# EAGLE design Arky TR595 Top Panel Eagle (EAGLE 7.7.0)
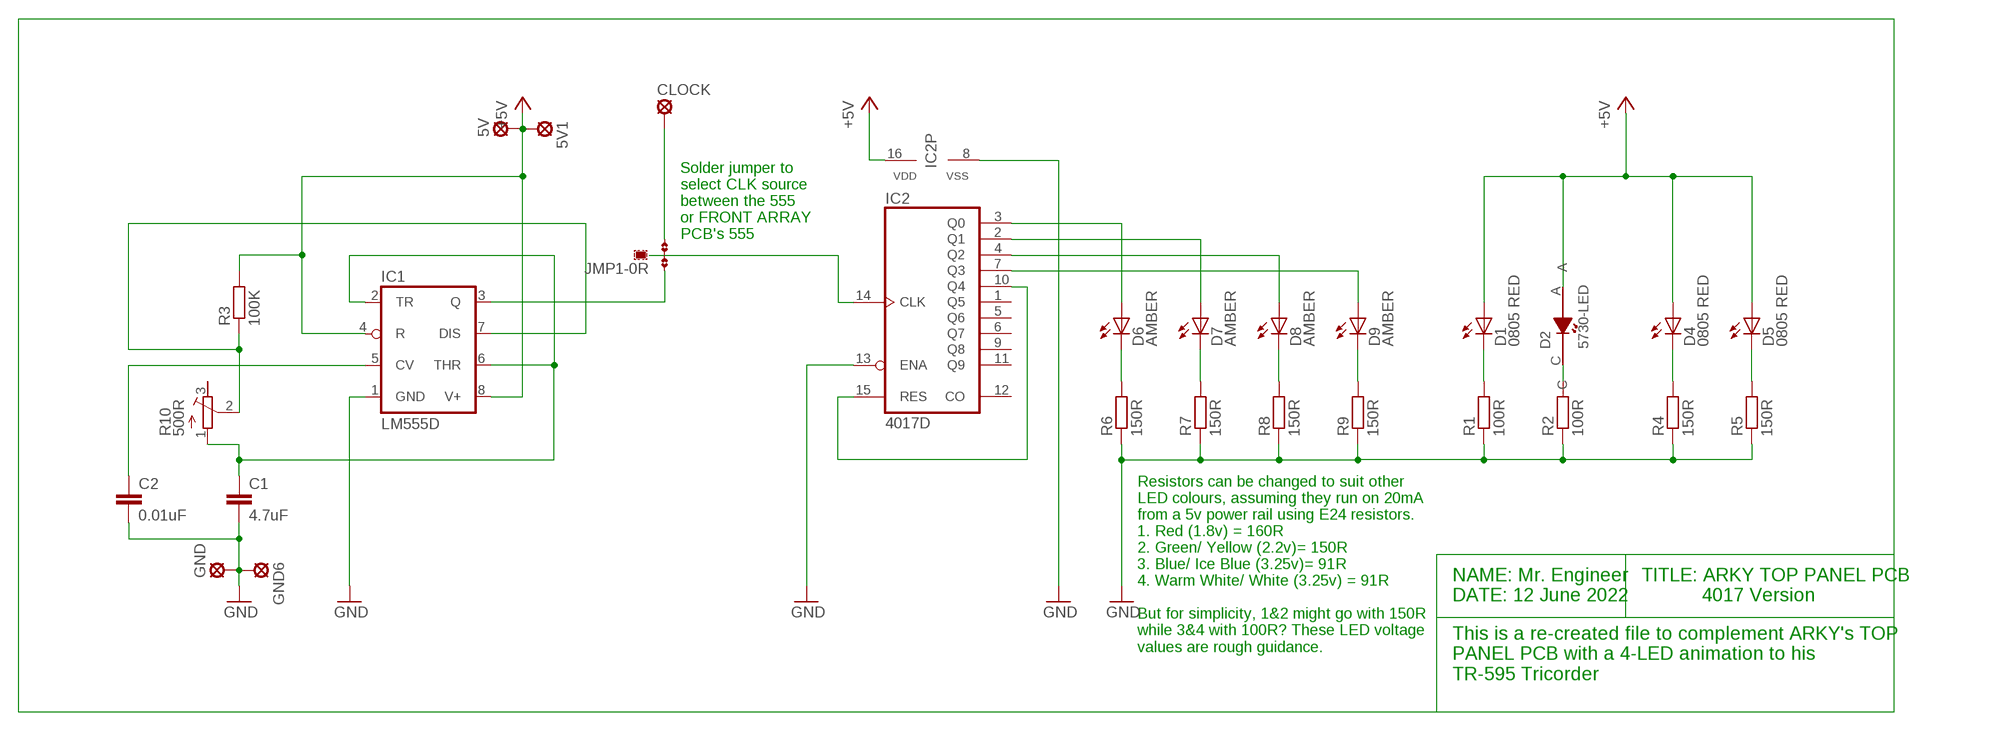
[diagram p0: schematic, sheet 1]

## Parts
5V  MCS10B  [MCS10B]
5V1  MCS10B  [MCS10B]
C1  4.7uF  C-EUC0805  [C0805]
C2  0.01uF  C-EUC0805  [C0805]
CLOCK  MCS10B  [MCS10B]
D1  0805 RED  LEDCHIPLED_0805  [CHIPLED_0805]
D2  5730-LED  [5730-LED]
D4  0805 RED  LEDCHIPLED_0805  [CHIPLED_0805]
D5  0805 RED  LEDCHIPLED_0805  [CHIPLED_0805]
D6  AMBER  LEDCHIPLED_0805  [CHIPLED_0805]
D7  AMBER  LEDCHIPLED_0805  [CHIPLED_0805]
D8  AMBER  LEDCHIPLED_0805  [CHIPLED_0805]
D9  AMBER  LEDCHIPLED_0805  [CHIPLED_0805]
GND  MCS10B  [MCS10B]
GND6  MCS10B  [MCS10B]
IC1  LM555D  [SO08]
IC2  4017D  [SO16]
JMP1  0R-JUMPA  [A0R-JMP]
R1  100R  R-EU_R0805  [R0805]
R2  100R  R-EU_R0805  [R0805]
R3  100K  R-EU_R0805  [R0805]
R4  150R  R-EU_R0805  [R0805]
R5  150R  R-EU_R0805  [R0805]
R6  150R  R-EU_R0805  [R0805]
R7  150R  R-EU_R0805  [R0805]
R8  150R  R-EU_R0805  [R0805]
R9  150R  R-EU_R0805  [R0805]
R10  500R  R-TRIMM3103  [RTRIM3103]

## Nets
+5V: 5V1.MP 5V.MP D1.A D2.A D4.A D5.A IC1.4(R) IC1.8(V+) IC2.16(VDD) R3.2
GND: IC2.8(VSS)
N$1: IC1.3(Q) JMP1.1
N$2: C2.1 IC1.5(CV)
N$3: D6.C R6.2
N$4: D7.C R7.2
N$5: D8.C R8.2
N$6: D9.C R9.2
N$7: C1.1 IC1.2(TR) IC1.6(THR) R10.1(A)
N$8: D6.A IC2.3(Q0)
N$9: D7.A IC2.2(Q1)
N$10: D8.A IC2.4(Q2)
N$11: D9.A IC2.7(Q3)
N$12: IC2.10(Q4) IC2.15(RES)
N$13: D4.C R4.2
N$14: D5.C R5.2
N$15: D1.C R1.2
N$16: D2.C R2.2
N$17: IC1.7(DIS) R3.1 R10.2(S)
N$18: IC2.14(CLK) JMP1.2
N$20: CLOCK.MP JMP1.3
N$21: C1.2 C2.2 GND6.MP GND.MP IC1.1(GND) IC2.13(ENA) R1.1 R2.1 R4.1 R5.1 R6.1 R7.1 R8.1 R9.1 ; supply symbol labelled GND
Unconnected: IC2.1(Q5) IC2.5(Q6) IC2.6(Q7) IC2.9(Q8) IC2.11(Q9) IC2.12(CO) R10.3(E)

## Notes on the sheet
- Solder jumper to
  select CLK source
  between the 555
  or FRONT ARRAY
  PCB's 555
- Resistors can be changed to suit other
  LED colours, assuming they run on 20mA
  from a 5v power rail using E24 resistors.
  1. Red (1.8v) = 160R
  2. Green/ Yellow (2.2v)= 150R
  3. Blue/ Ice Blue (3.25v)= 91R
  4. Warm White/ White (3.25v) = 91R
  
  But for simplicity, 1&2 might go with 150R
  while 3&4 with 100R? These LED voltage
  values are rough guidance.
- NAME: Mr. Engineer
  DATE: 12 June 2022
- TITLE: ARKY TOP PANEL PCB
             4017 Version
- This is a re-created file to complement ARKY's TOP
  PANEL PCB with a 4-LED animation to his
  TR-595 Tricorder

## Library data of the parts
5V 5V1 CLOCK GND GND6 = solpad:MCS10B: SOLDER PAD MC S1, distributor Buerklin, 15F505
C1 C2 = rcl:C-EU: CAPACITOR, European symbol
D1 D4-D9 = led:LED: LED OSRAM: - CHIPLED LG R971, LG N971, LY N971, LG Q971, LY Q971, LO R971, LY R971 LH N974, LH R974 LS Q976, LO Q976, LY Q976 LO Q996 - Hyper CHIPLED LW Q18S LB Q993, LB Q99A, LB R99A - SideLED LS A670, LO A670, LY A670, LG A670, LP A670 LB A673, LV A673, LT A673, LW A673 LH A674 LY A675 LS A676, LA A676, LO A676, LY A676, LW A676 LS A679, LY A679, LG A679 - Hyper Micro SIDELED® LS Y876, LA Y876, LO Y876, LY Y876 LT Y87S - SmartLED LW L88C, LW L88S LB L89C, LB L89S, LG L890 LS L89K, LO L89K, LY L89K LS L896, LA L896, LO L896, LY L896 - TOPLED LS T670, LO T670, LY T670, LG T670, LP T670 LSG T670, LSP T670, LSY T670, LOP T670, LYG T670 LG T671, LOG T671, LSG T671 LB T673, LV T673, LT T673, LW T673 LH T674 LS T676, LA T676, LO T676, LY T676, LB T676, LH T676, LSB T676, LW T676 LB T67C, LV T67C, LT T67C, LS T67K, LO T67K, LY T67K, LW E67C LS E67B, LA E67B, LO E67B, LY E67B, LB E67C, LV E67C, LT E67C LW T67C LS T679, LY T679, LG T679 LS T770, LO T770, LY T770, LG T770, LP T770 LB T773, LV T773, LT T773, LW T773 LH T774 LS E675, LA E675, LY E675, LS T675 LS T776, LA T776, LO T776, LY T776, LB T776 LHGB T686 LT T68C, LB T68C - Hyper Mini TOPLED® LB M676 - Mini TOPLED Santana® LG M470 LS M47K, LO M47K, LY M47K Source: http://www.osram.convergy.de LUXEON: - LUMILED® LXK2-PW12-R00, LXK2-PW12-S00, LXK2-PW14-U00, LXK2-PW14-V00 LXK2-PM12-R00, LXK2-PM12-S00, LXK2-PM14-U00 LXK2-PE12-Q00, LXK2-PE12-R00, LXK2-PE12-S00, LXK2-PE14-T00, LXK2-PE14-U00 LXK2-PB12-K00, LXK2-PB12-L00, LXK2-PB12-M00, LXK2-PB14-N00, LXK2-PB14-P00, LXK2-PB14-Q00 LXK2-PR12-L00, LXK2-PR12-M00, LXK2-PR14-Q00, LXK2-PR14-R00 LXK2-PD12-Q00, LXK2-PD12-R00, LXK2-PD12-S00 LXK2-PH12-R00, LXK2-PH12-S00 LXK2-PL12-P00, LXK2-PL12-Q00, LXK2-PL12-R00 Source: www.luxeon.com KINGBRIGHT: KA-3528ASYC Source: www.kingbright.com
D2 = Chow 5730 LED:5730-LED
IC1 = adafruit:*555: TIMER Changed DIP package to have round (not oval) pin pads http://www.ladyada.net/library/pcb/eaglelibrary.html
IC2 = 40xx:4017: COUNTER/DIVIDER
JMP1 = jump-0r-smd:0R-JUMP: SMD 0R 0805 Jumper
R1-R9 = rcl:R-EU_: RESISTOR, European symbol
R10 = rcl:R-TRIMM: Trimm resistor

## Board
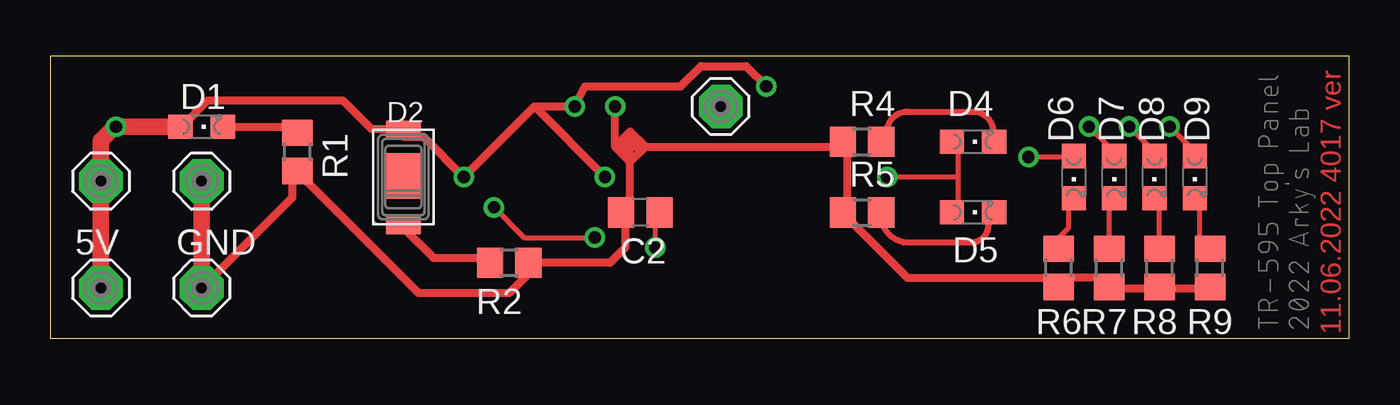
[diagram p1: board, top side]
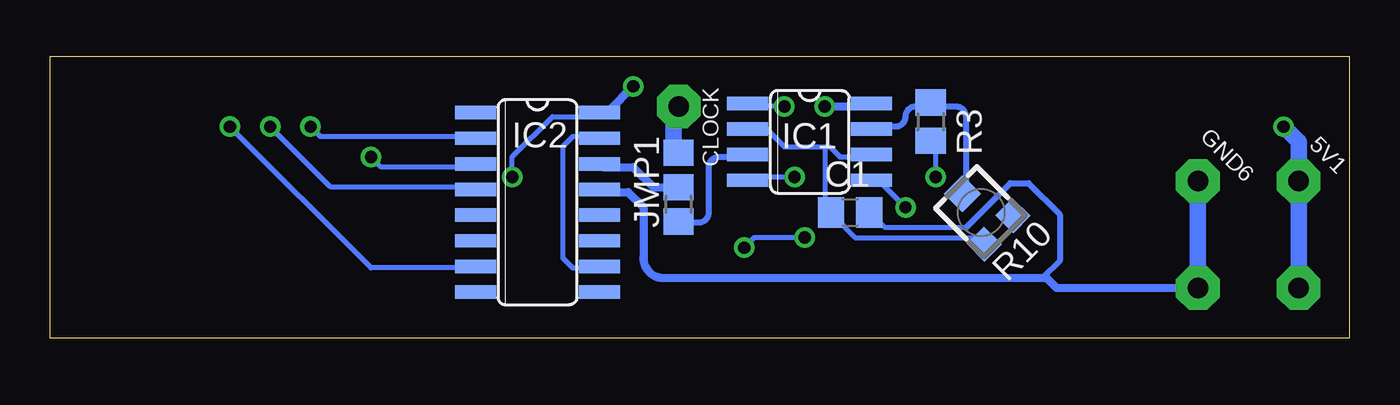
[diagram p2: board, bottom side, seen from below]

Size 64.4 x 14 mm. Coordinates in mm from the lower left corner, seen from the top.
Outline: 0,0 64.4,0 64.4,14 0,14 0,0
Copper layers (1*16): Top 0.035mm / dielectric 1.5mm / Bottom 0.035mm
Design rules "default": minimum track width 10mil, minimum drill 24mil, track to track 8mil, track to pad 8mil, pad to pad 8mil, via to via 8mil, smd to smd 8mil, copper to edge 40mil, drill to drill 8mil, minimum pad ring 10mil, minimum via ring 8mil, stop-mask expansion 4mil, vias tented up to drill 0mil, thermal gap 10mil

### Footprints (pad centres in the part's own frame; a part is rotated, then mirrored left to right if it is on the bottom)
MCS10B = drill 1.016 pad 2.159 octagon: MP 0,0
C0805 = smd 1.3 x 1.5: 1 -0.95,0; 2 0.95,0
CHIPLED_0805 = smd 1.2 x 1.2: A 0,-1.05; C 0,1.05
5730-LED = smd 0.9 x 1.7: A -2.35,0; C 2.38,0 | smd 2.25 x 1.7: P$2 -0.055,0
SO08 = smd 0.66 x 2.032: 1 -1.905,-3.073; 2 -0.635,-3.073; 3 0.635,-3.073; 4 1.905,-3.073; 5 1.905,3.073; 6 0.635,3.073; 7 -0.635,3.073; 8 -1.905,3.073
SO16 = smd 0.66 x 2.032: 1 -4.445,-3.073; 2 -3.175,-3.073; 3 -1.905,-3.073; 4 -0.635,-3.073; 5 0.635,-3.073; 6 1.905,-3.073; 7 3.175,-3.073; 8 4.445,-3.073; 9 4.445,3.073; 10 3.175,3.073; 11 1.905,3.073; 12 0.635,3.073; 13 -0.635,3.073; 14 -1.905,3.073; 15 -3.175,3.073; 16 -4.445,3.073
A0R-JMP = smd 1.5 x 1.3: 1 0,1.7; 2 0,0; 3 0,-1.7
R0805 = smd 1.3 x 1.5: 1 -0.95,0; 2 0.95,0
RTRIM3103 = smd 1.2 x 1.25: 1 -1,-1.225; 3 1,-1.225 | smd 1.3 x 1.3: 2 0,1.3

### Placement (x,y rotation side)
5V  2.5,2.5 0 top
5V1  2.5,7.8 0 top
C1  24.75,6.25 0 bottom
C2  29.25,6.25 180 top
CLOCK  33.25,11.5 180 top
D1  7.5,10.5 270 top
D2  17.5,8 270 top
D4  45.75,9.75 270 top
D5  45.75,6.25 270 top
D6  50.75,8 180 top
D7  52.75,8 180 top
D8  54.75,8 180 top
D9  56.75,8 180 top
GND  7.5,2.5 0 top
GND6  7.5,7.8 0 top
IC1  26.75,9.75 270 bottom
IC2  40.25,6.75 270 bottom
JMP1  33.25,7.5 180 bottom
R1  12.25,9.25 90 top
R2  22.75,3.75 180 top
R3  20.75,10.75 270 bottom
R4  40.25,9.75 0 top
R5  40.25,6.25 0 top
R6  50,3.5 90 top
R7  52.5,3.5 90 top
R8  55,3.5 90 top
R9  57.5,3.5 90 top
R10  18.25,6.25 45 bottom

### Tracks (layer width: path | path; a pad name or v marks a point on that pad's centre or on a via)
+5V  (via drill 0.6, 0.61)
  Top 0.254: 45,8 45,9.5 D4.A | 45,8 45,6.5 D5.A | 45,8 v41.5,8 | 17.5,10 D2.A
  Top 0.406: 17.5,10 18.5,10 v20.5,8 24,11.5 | 24,11.5 v26,11.5 26.5,12.5 31.25,12.5 32.25,13.5 34.5,13.5 v35.5,12.5 | 24,11.5 v27.5,8 | 6.5,10.5 7.8,11.8 14.5,11.8 15.9,10.4 17.45,10.4 D2.A | v3.25,10.5 3.3,10.5 D1.A
  Top 0.813: 5V.MP 2.5,9.8 3.2,10.5 | 3.3,10.4 3.2,10.5 | 3.2,10.5 3.3,10.5 6.5,10.5
  Bottom 0.254: v41.5,8 41.5,9 39.5,11 37.5,11 IC2.16 37.75,11.25 | v20.5,8 20.5,9.5 R3.2 | 24.5,11.5 IC1.8 | v27.5,8 29.5,8 IC1.4
  Bottom 0.406: v26,11.5 24.5,11.5 | 37.75,11.25 36.75,11.25 v35.5,12.5
  Bottom 0.813: 5V.MP 5V1.MP 2.5,9.75 v3.25,10.5
N$1
  Bottom 0.254: 32.5,5.75 JMP1.1 | 30,9 IC1.3
  Bottom 0.305: 32.5,5.75 32.25,5.75 arc-90 31.75,6.25 31.75,8.5 arc90 31.25,9 29.94,9 arc-90 IC1.3
N$2  (via drill 0.61)
  Top 0.254: v30,4.5 30,6 C2.1 | v27,5 23.5,5 v22,6.5
  Bottom 0.254: v30,4.5 29.5,5 v27,5 | v22,6.5 23.5,8 IC1.5
N$3
  Top 0.254: R6.2 50,5 50.5,5.5 50.5,6.5 D6.C
N$4
  Top 0.254: R7.2 52.5,6.5 D7.C
N$5
  Top 0.254: R8.2 55,6.5 D8.C
N$6
  Top 0.254: D9.C 57,6.5 57,5 57.5,4.5 R9.2
N$7
  Bottom 0.254: R10.1 18.5,5 24.5,5 25.5,6 C1.1 26,6.5 26,9.5 | 26,9.5 28,9.5 29,10.5 29.5,10.5 IC1.2 | 26,9.5 25.75,9.5 25.25,9 23.79,9
  Bottom 0.305: 23.79,9 IC1.6
N$8  (via drill 0.61)
  Top 0.254: v48.5,9 50.5,9 D6.A
  Bottom 0.254: v48.5,9 48,8.5 43.5,8.5 IC2.3
N$9  (via drill 0.61)
  Top 0.254: v51.5,10.5 52.5,9.5 D7.A
  Bottom 0.254: v51.5,10.5 51,10 43.5,10 IC2.2
N$10  (via drill 0.61)
  Top 0.254: v53.5,10.5 54.5,9.5 D8.A
  Bottom 0.254: v53.5,10.5 50.5,7.5 43.5,7.5 IC2.4
N$11  (via drill 0.61)
  Top 0.254: v55.5,10.5 56.5,9.5 D9.A
  Bottom 0.254: v55.5,10.5 48.5,3.5 43.5,3.5 IC2.7
N$12
  Bottom 0.254: IC2.10 37.5,3.5 38.5,3.5 39,4 39,9.5 38.5,10 37,10 IC2.15
N$13
  Top 0.254: 46.5,10 D4.C | 41.5,10 R4.2
  Top 0.305: 41.5,10 41.5,10.25 arc-90 42.5,11.25 45.75,11.25 arc-90 46.75,10.25 46.75,9.8 arc90 D4.C
N$14
  Top 0.254: 46.5,6 D5.C | 41.5,6 R5.2
  Top 0.305: 46.5,6 46.5,5.75 arc-90 45.75,4.75 42.45,4.75 arc-90 R5.2
N$15
  Top 0.254: 12,10.5 R1.2
  Top 0.406: D1.C 11.95,10.5 R1.2
N$16
  Top 0.254: 21.5,4 R2.2 | 17.5,5.5 D2.C
  Top 0.406: 21.5,4 19,4 17.5,5.5
N$17
  Bottom 0.254: 20.5,11.5 R3.1 21,11.5 | 23.5,10.5 IC1.7
  Bottom 0.305: 21,11.5 21.5,11.5 arc-90 22,11 arc90 22.5,10.5 23.56,10.5 arc-90 IC1.7 | 20.5,11.5 19.5,11.5 arc90 19,11 19,7.34 arc90 R10.2
N$18
  Bottom 0.254: 37,8.5 IC2.14
  Bottom 0.406: 37,8.5 35.5,8.5 34.5,7.5 JMP1.2
N$20
  Bottom 0.254: 33.5,9.5 JMP1.3 | 33.5,11.5 CLOCK.MP
  Bottom 0.813: 33.5,11.5 33.5,9.5
N$21  (via drill 0.61)
  Top 0.254: 12,8 R1.1 12.5,8 | 52.5,3 R7.1 52.5,2.5 | 57.5,2.5 R9.1 | 55,2.5 R8.1 | 39.5,6.5 R5.1 39.5,6 | 39.5,9.5 R4.1 39,9.5 | 23.75,3.75 R2.1 24,3.5 | 28.5,6 C2.2 28.75,6.5 | 50,3 R6.1
  Top 0.406: 12,8 12,7 GND.MP | 52.5,3 50,3 42.5,3 39.5,6 | 52.5,2.5 55,2.5 57.5,2.5 | 39.5,9.5 39.5,6.5 | 23.75,3.75 27.75,3.75 28.5,4.5 28.5,6 | 28.75,8.75 28,9.5 | 28,9.5 v28,11.5 | 28.75,6.5 28.75,8.75 | 28.25,9.5 28.75,9.5 | 28.75,9.5 29.5,9.5 | 29.5,9.5 39,9.5 | 12.5,8 18.25,2.25 22.75,2.25 24,3.5 | 28.75,8.75 28.75,9.5 | 28.75,9.5 arc-90 28.5,9.25 | 28.75,8.75 29.5,9.5 | 29.5,9.5 28.75,10.25 28,9.5 | 28,9.5 28.25,9.5 | 28.25,9.5 28.75,10 29,9.75 28.75,9.75
  Top 0.813: GND.MP GND6.MP
  Bottom 0.254: 19,5.5 23,5.5 23.5,6 C1.2 | 37,7.5 IC2.13 | v28,11.5 29.5,11.5 IC1.1
  Bottom 0.305: 19,5.5 16.8,7.7 15.9,7.7 14.35,6.15 14.35,3.85 15.2,3
  Bottom 0.406: GND.MP 14.5,2.5 15,3 15.2,3 34,3 arc90 35,4 35,6.5 35.75,7.25 37.18,7.25 IC2.13
  Bottom 0.813: GND6.MP GND.MP
S$14
  Top 0.152: 46.98,6.21 46.97,6.2
S$18
  Top 0.152: 52.93,9.2 52.52,8.79
S$23
  Top 0.152: 47.02,9.81 46.98,9.76
S$40
  Top 0.152: 50.54,2.51 50.49,2.56
S$58
  Top 0.152: 50.47,4.42 50.49,4.4

### Text on the board
Top: 11.06.2022 4017 ver
tDocu: 11.06.2022 4017 ver
bDocu: 555